# Altium project mycar_pcb.PrjPcb
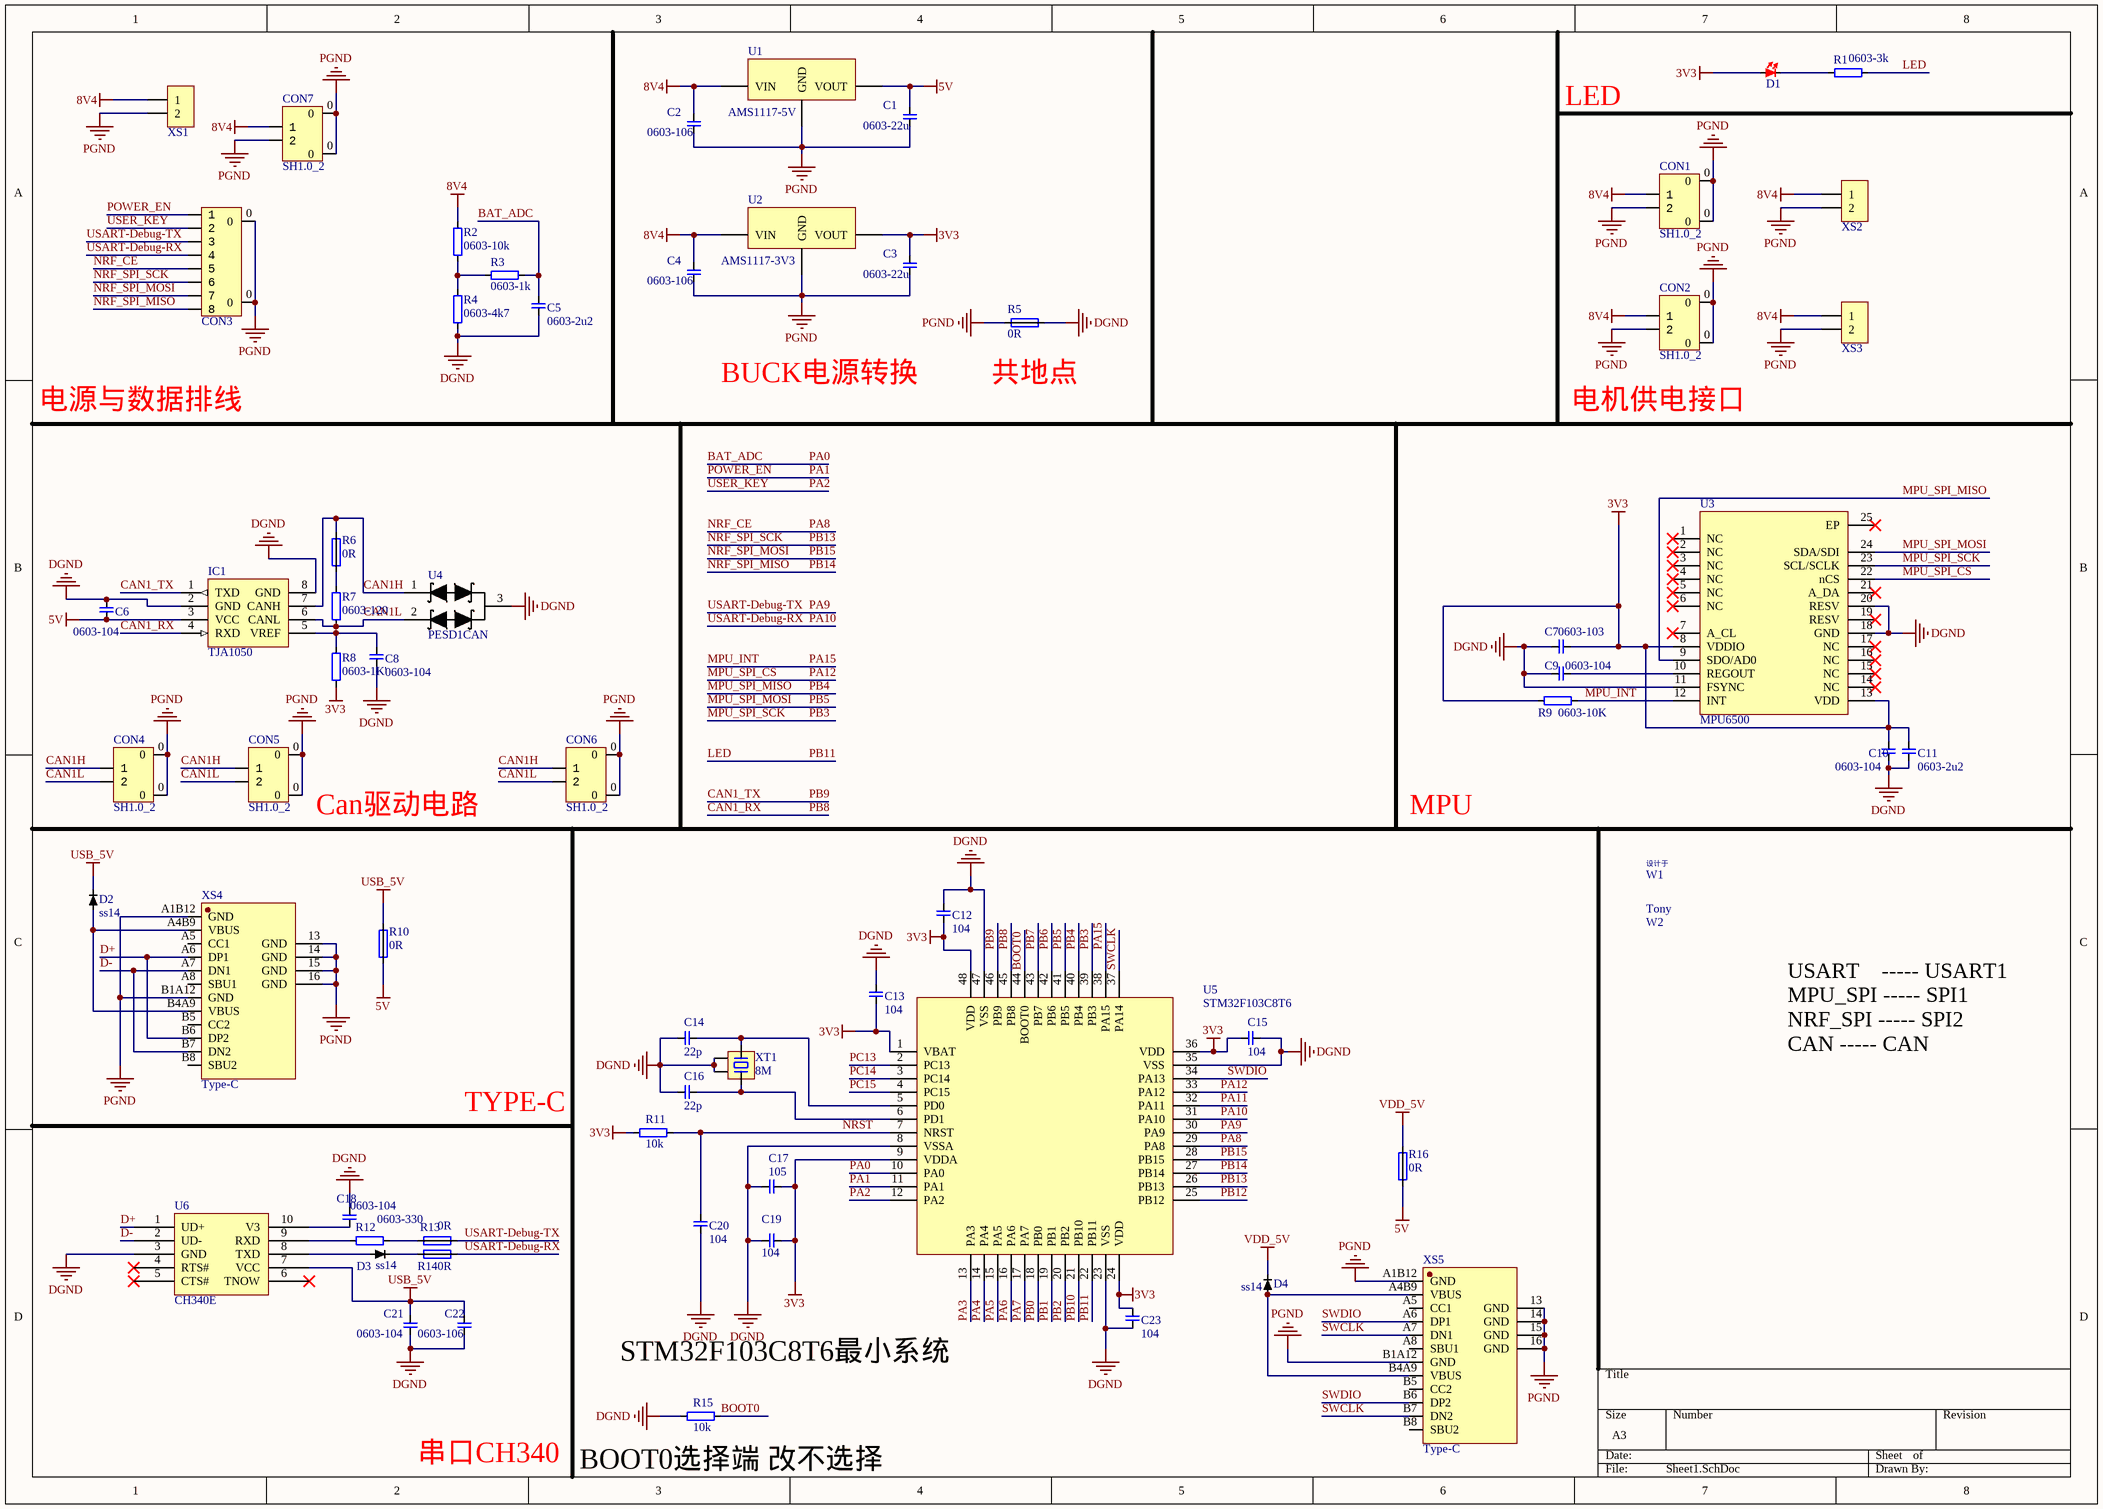
[diagram p0: Sheet1.SchDoc]
1 sheet, 65 parts. Net scope: global (net labels, ports and power ports of the same name join across sheets).
Board file: PCB1.PcbDoc

## Sheet Sheet1.SchDoc
size A3; SheetNumber: 1; SheetTotal: 1

### Parts
C1  0603-22u  [CAP_0603]
C2  0603-106  [CAP_0603]
C3  0603-22u  [CAP_0603]
C4  0603-106  [CAP_0603]
C5  0603-2u2  [CAP_0603]
C6  0603-104  [CAP_0603]
C7  0603-103  [CAP_0603]
C8  0603-104  [CAP_0603]
C9  0603-104  [CAP_0603]
C10  0603-104  [CAP_0603]
C11  0603-2u2  [CAP_0603]
C12  104  [CAP_0603]
C13  104  [CAP_0603]
C14  22p  [CAP_0603]
C15  104  [CAP_0603]
C16  22p  [CAP_0603]
C17  105  [CAP_0603]
C18  0603-104  [CAP_0603]
C19  104  [CAP_0603]
C20  104  [CAP_0603]
C21  0603-104  [CAP_0603]
C22  0603-106  [CAP_0603]
C23  104  [CAP_0603]
CON1  SH1.0_2  [SH1.0 Vertical 2P]
CON2  SH1.0_2  [SH1.0 Vertical 2P]
CON3  FFC_0.5_8  [FFC_0.5_8]  (value not drawn)
CON4  SH1.0_2  [SH1.0 Vertical 2P]
CON5  SH1.0_2  [SH1.0 Vertical 2P]
CON6  SH1.0_2  [SH1.0 Vertical 2P]
CON7  SH1.0_2  [SH1.0 Vertical 2P]
D1  led  [led0603]  (value not drawn)
D2  ss14  [SOD-323]
D3  ss14  [SOD-323]
D4  ss14  [SOD-323]
IC1  TJA1050  [SOP8_N]
R1  0603-3k  [RES_0603]
R2  0603-10k  [RES_0603]
R3  0603-1k  [RES_0603]
R4  0603-4k7  [RES_0603]
R5  0R  [RES_0805-SHORT]
R6  0R  [RES_0603-SHORT]
R7  0603-120  [RES_0603]
R8  0603-1K'  [RES_0603]
R9  0603-10K  [RES_0603]
R10  0R  [RES_0805-SHORT]
R11  10k  [RES_0603]
R12  0603-330  [RES_0603]
R13  0R  [RES_0402-SHORT]
R14  0R  [RES_0402-SHORT]
R15  10k  [RES_0603]
R16  0R  [RES_0805-SHORT]
U1  AMS1117-5V  [SOT223]
U2  AMS1117-3V3  [SOT223]
U3  MPU6500  [QFN-24_3X3]
U4  PESD1CAN  [SOT23-3]
U5  STM32F103C8T6  [LQFP48]
U6  CH340E  [MSOP10]
W1  设计于  [designed by（430-70）]  (value not drawn)
W2  Tony  [Tony_2(200-70)]  (value not drawn)
XS1  HDR-1X2  [15EDGVM-2P]  (value not drawn)
XS2  HDR-1X2  [HDR2]  (value not drawn)
XS3  HDR-1X2  [HDR2]  (value not drawn)
XS4  Type-C  [TypeC-304-16BCP]
XS5  Type-C  [TypeC-304-16BCP]
XT1  8M  [SMD3225_4p]

### Nets
3V3: C3.2 C7.2 C10.2 C11.2 C12.2 C13.1 C15.2 C17.2 C19.2 C23.2 D1.1 R8.1 R9.1 R11.1 U2.2(VOUT) U3.8(VDDIO) U3.13(VDD) U5.1(VBAT) U5.9(VDDA) U5.24(VDD) U5.36(VDD) U5.48(VDD)
5V: C1.2 C6.1 IC1.3(VCC) R10.1 R16.1 U1.2(VOUT)
8V4: C2.2 C4.2 CON1.1 CON2.1 CON7.1 R2.2 U1.3(VIN) U2.3(VIN) XS1.1 XS2.1 XS3.1
DGND: C5.1 C6.2 C7.1 C8.1 C9.1 C10.1 C11.1 C12.1 C13.2 C14.2 C15.1 C16.2 C17.1 C18.2 C19.1 C20.2 C21.1 C22.1 C23.1 IC1.2(GND) IC1.8(GND) R4.1 R5.1 R15.1 U3.11(FSYNC) U3.18(GND) U3.20(RESV) U4.3 U5.8(VSSA) U5.23(VSS) U5.35(VSS) U5.47(VSS) U6.3(GND) XT1.2(GND) XT1.4(GND)
PGND: C1.1 C2.1 C3.1 C4.1 CON1.0 CON1.2 CON2.0 CON2.2 CON3.0 CON4.0 CON5.0 CON6.0 CON7.0 CON7.2 R5.2 U1.1(GND) U2.1(GND) XS1.2 XS2.2 XS3.2 XS4.13(GND) XS4.14(GND) XS4.15(GND) XS4.16(GND) XS4.A1B12(GND) XS4.B1A12(GND) XS5.13(GND) XS5.14(GND) XS5.15(GND) XS5.16(GND) XS5.A1B12(GND) XS5.B1A12(GND)
USB_5V: C21.2 C22.2 D2.2 R10.2 U6.7(VCC)
VDD_5V: D4.2 R16.2
BAT_ADC: C5.2 R3.1 U5.10(PA0)  [also labelled PA0]
BOOT0: R15.2 U5.44(BOOT0)
CAN1_RX: IC1.4(RXD) U5.45(PB8)  [also labelled PB8]
CAN1_TX: IC1.1(TXD) U5.46(PB9)  [also labelled PB9]
CAN1H: CON4.1 CON5.1 CON6.1 IC1.7(CANH) R6.1 U4.1
CAN1L: CON4.2 CON5.2 CON6.2 IC1.6(CANL) R7.1 U4.2
D+: U6.1(UD+) XS4.A6(DP1) XS4.B6(DP2)
D-: U6.2(UD-) XS4.A7(DN1) XS4.B7(DN2)
LED: R1.2 U5.22(PB11)  [also labelled PB11]
MPU_INT: R9.2 U3.12(INT) U5.38(PA15)  [also labelled PA15]
MPU_SPI_CS: U3.22(nCS) U5.33(PA12)  [also labelled PA12]
MPU_SPI_MISO: U3.9(SDO/AD0) U5.40(PB4)  [also labelled PB4]
MPU_SPI_MOSI: U3.24(SDA/SDI) U5.41(PB5)  [also labelled PB5]
MPU_SPI_SCK: U3.23(SCL/SCLK) U5.39(PB3)  [also labelled PB3]
NRF_CE: CON3.5 U5.29(PA8)  [also labelled PA8]
NRF_SPI_MISO: CON3.8 U5.27(PB14)  [also labelled PB14]
NRF_SPI_MOSI: CON3.7 U5.28(PB15)  [also labelled PB15]
NRF_SPI_SCK: CON3.6 U5.26(PB13)  [also labelled PB13]
NRST: C20.1 R11.2 U5.7(NRST)
PA1: CON3.1 U5.11(PA1)  [also labelled POWER_EN]
PA2: CON3.2 U5.12(PA2)  [also labelled USER_KEY]
PA3: U5.13(PA3)
PA4: U5.14(PA4)
PA5: U5.15(PA5)
PA6: U5.16(PA6)
PA7: U5.17(PA7)
PA9: CON3.3 R13.2 U5.30(PA9)  [also labelled USART-Debug-TX]
PA10: CON3.4 R14.2 U5.31(PA10)  [also labelled USART-Debug-RX]
PA11: U5.32(PA11)
PB0: U5.18(PB0)
PB1: U5.19(PB1)
PB2: U5.20(PB2)
PB6: U5.42(PB6)
PB7: U5.43(PB7)
PB10: U5.21(PB10)
PB12: U5.25(PB12)
PC13: U5.2(PC13)
PC14: U5.3(PC14)
PC15: U5.4(PC15)
SWCLK: U5.37(PA14) XS5.A7(DN1) XS5.B7(DN2)
SWDIO: U5.34(PA13) XS5.A6(DP1) XS5.B6(DP2)
NetC8_2: C8.2 IC1.5(VREF) R8.2
NetC9_2: C9.2 U3.10(REGOUT)
NetC14_1: C14.1 U5.5(PD0) XT1.1
NetC16_1: C16.1 U5.6(PD1) XT1.3
NetC18_1: C18.1 U6.10(V3)
NetD1_2: D1.2 R1.1
NetD2_1: D2.1 XS4.A4B9(VBUS) XS4.B4A9(VBUS)
NetD3_1: D3.1 U6.8(TXD)
NetD3_2: D3.2 R14.1
NetD4_1: D4.1 XS5.A4B9(VBUS) XS5.B4A9(VBUS)
NetR2_1: R2.1 R3.2 R4.2
NetR6_2: R6.2 R7.2
NetR12_1: R12.1 U6.9(RXD)
NetR12_2: R12.2 R13.1

Not connected (* = marked no-connect by the designer): U3 1(NC)* 2(NC)* 3(NC)* 4(NC)* 5(NC)* 6(NC)* 7(A_CL)* 14(NC)* 15(NC)* 16(NC)* 17(NC)* 19(RESV)* 21(A_DA)* 25(EP)*; U6 4(RTS#)* 5(CTS#)* 6(TNOW)*; XS4 A5(CC1) A8(SBU1) B5(CC2) B8(SBU2); XS5 A5(CC1) A8(SBU1) B5(CC2) B8(SBU2)

### Notes on the sheet
- LED
- 电源与数据排线
- BUCK电源转换
- (near R5) 共地点
- (near CON2) 电机供电接口
- (near CON5) Can驱动电路
- MPU
- TYPE-C
- USART    ----- USART1
  MPU_SPI ----- SPI1
  NRF_SPI ----- SPI2
  CAN ----- CAN
- (near R15) STM32F103C8T6最小系统
- 串口CH340
- (near R15) BOOT0选择端 改不选择

### Library data of the parts
C1-C23 = cap
CON1 CON2 CON4-CON7 = SH1.0_2: SH1.0 座子
CON3 = FFC_0.5_8: FFC; System: Connector
D2-D4 = Diode
IC1 = TJA1050: CAN总线收发芯片; 版权归属: 源创客; BOM名称: CAN总线收发芯片; 学习资源: www.ooocke.com
R1-R4 R7-R9 R11 R12 R15 = Res
R5 R6 R10 R13 R14 R16 = Res-SHORT
U1 U2 = AMS1117
U3 = MPU6500: 六轴传感器
U4 = PESD1CAN: CAN过压保护,放于外部接口端
U5 = STM32F103C8T6-LCC
U6 = CH340E: USB转串口 无外置晶振
XS1-XS3 = Header 2: 2P接插件; 版权归属: 源创客; BOM名称: 2P接插件; 学习资源: www.ooocke.com
XS4 XS5 = Type-C母口
XT1 = XTAL-4P